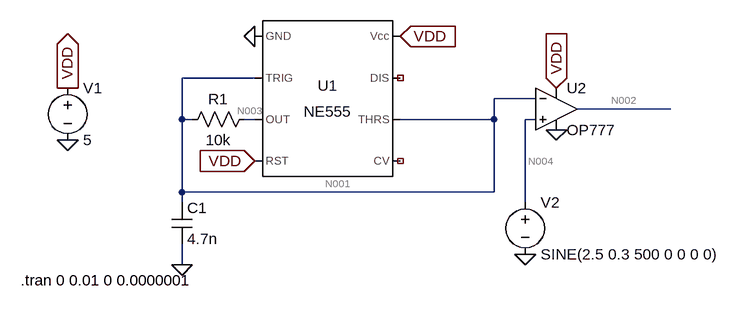
[diagram p0: schematic audio_modulation.asc]
audio_modulation.asc, the LTspice schematic file:
Version 4
SHEET 1 880 680
WIRE 0 128 -112 128
WIRE 432 160 368 160
WIRE 640 176 496 176
WIRE -112 192 -112 128
WIRE -96 192 -112 192
WIRE 0 192 -16 192
WIRE 368 192 368 160
WIRE 368 192 224 192
WIRE 432 192 416 192
WIRE -112 304 -112 192
WIRE 368 304 368 192
WIRE 368 304 -112 304
WIRE -112 320 -112 304
WIRE 416 320 416 192
WIRE -112 416 -112 384
FLAG -288 224 0
FLAG 0 64 0
FLAG -288 144 VDD
IOPIN -288 144 Out
FLAG 224 64 VDD
IOPIN 224 64 In
FLAG 0 256 VDD
IOPIN 0 256 In
FLAG -112 416 0
FLAG 464 144 VDD
IOPIN 464 144 In
FLAG 464 208 0
FLAG 416 400 0
SYMBOL Misc\\NE555 112 160 R0
SYMATTR InstName U1
SYMBOL voltage -288 128 R0
WINDOW 123 0 0 Left 0
WINDOW 39 0 0 Left 0
SYMATTR InstName V1
SYMATTR Value 5
SYMBOL res 0 176 R90
WINDOW 0 0 56 VBottom 2
WINDOW 3 32 56 VTop 2
SYMATTR InstName R1
SYMATTR Value 10k
SYMBOL cap -128 320 R0
SYMATTR InstName C1
SYMATTR Value 4.7n
SYMBOL voltage 416 304 R0
WINDOW 123 0 0 Left 0
WINDOW 39 0 0 Left 0
SYMATTR InstName V2
SYMATTR Value SINE(2.5 0.3 500 0 0 0 0)
SYMBOL OpAmps\\OP777 464 112 R0
SYMATTR InstName U2
TEXT -360 440 Left 2 !.tran 0 0.01 0 0.0000001

The netlist it stands for:
* audio_modulation.asc
XU1 0 N001 N003 VDD NC_01 N001 NC_02 VDD NE555  ; pins GND TRIG OUT RST CV THRS DIS Vcc
V1 VDD 0 5
R1 N003 N001 10k
C1 N001 0 4.7n
V2 N004 0 SINE(2.5 0.3 500 0 0 0 0)
XU2 N004 N001 VDD 0 N002 OP777  ; pins In+ In- V+ V- OUT
.tran 0 0.01 0 0.0000001
.lib NE555.sub
.lib ADI.lib
.backanno
.end

* Results of the author's LTspice run, read from the files saved beside the schematic
* Operating Point, zero values left out:
*   V(n001) = 5 V
*   V(vdd) = 5 V
*   V(n003) = 5 V
*   V(n004) = 2.5 V
*   I(R1) = 11.01 nA
*   I(V2) = 22.64 nA
*   I(V1) = -1.674 mA
*   Ix(u1:1) = -1.611 mA
*   Ix(u1:2) = 5 nA
*   Ix(u1:3) = -11.01 nA
*   Ix(u1:4) = 22.67 µA
*   Ix(u1:6) = 5 nA
*   Ix(u1:8) = 1.588 mA
*   Ix(u2:1) = -22.64 nA
*   Ix(u2:2) = 1.007 nA
*   Ix(u2:99) = 63 µA
*   Ix(u2:50) = -62.98 µA
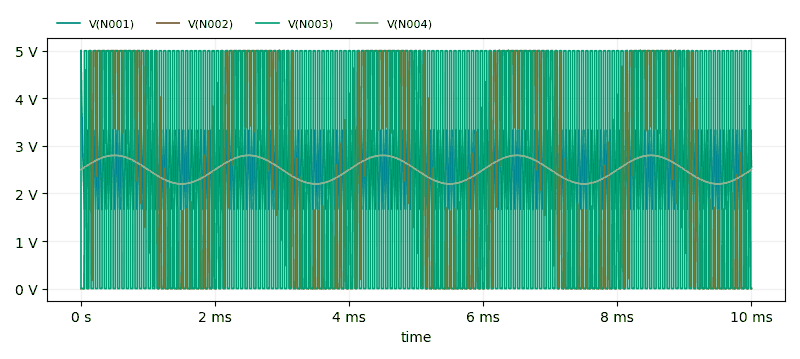
[diagram p1: Transient Analysis of audio_modulation.asc, plotted from the saved traces]
* Transient Analysis, 1 run:
*   V(N001): min 1.662 V, max 5 V, average 2.504 V, rms 2.555 V, last 2.557 V
*   V(N002): min -4.146 mV, max 5.006 V, average 2.494 V, rms 3.302 V, last -28.02 µV
*   V(N003): min 1.028 mV, max 5 V, average 2.492 V, rms 3.528 V, last 1.563 mV
*   V(N004): min 2.2 V, max 2.8 V, average 2.5 V, rms 2.509 V, last 2.5 V